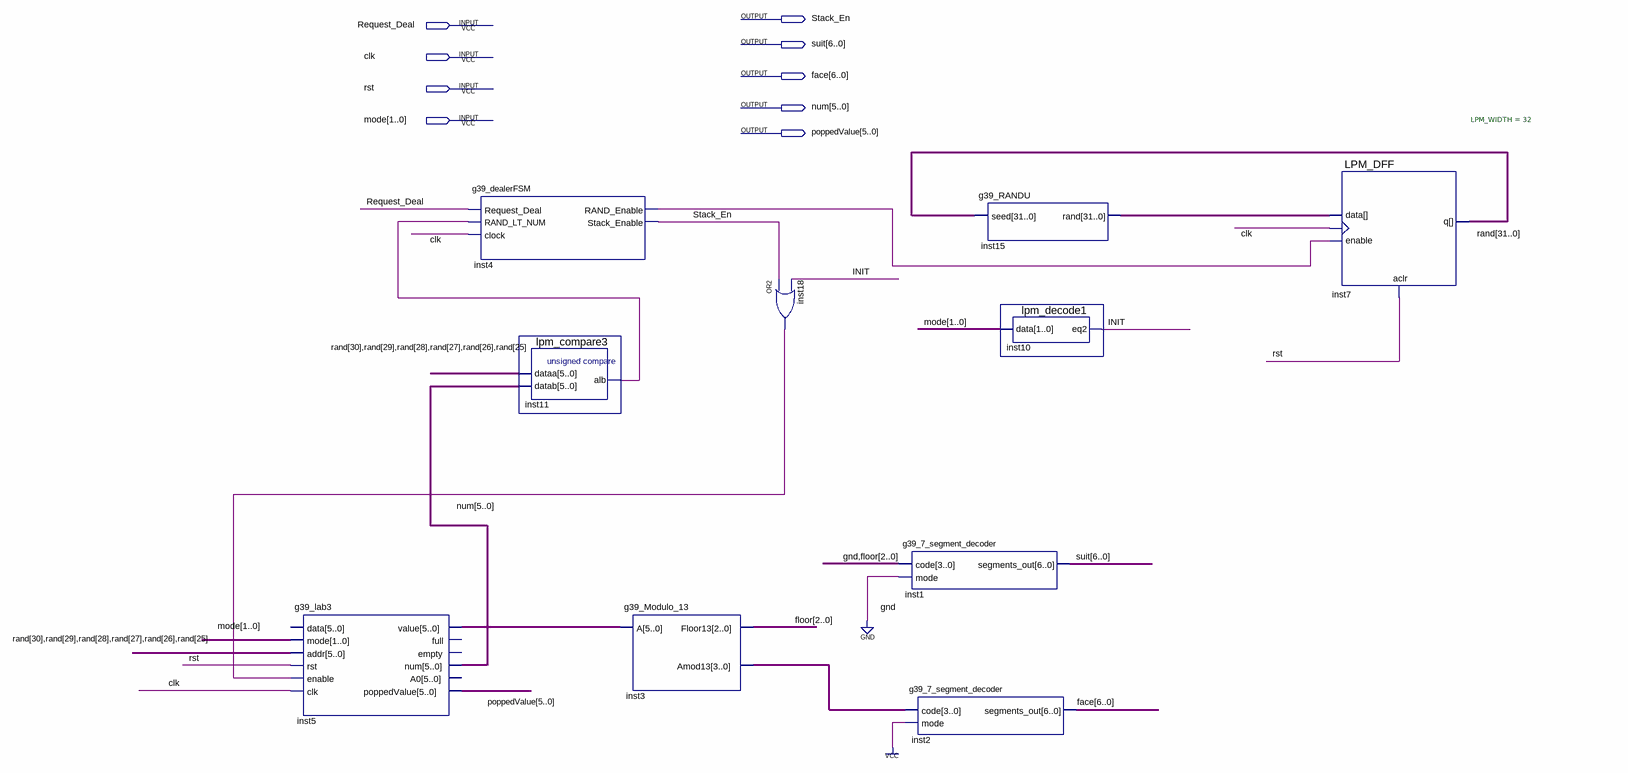
[diagram p0: schematic sheet]
// Quartus schematic g39_dealerTestBed.bdf as structural Verilog: 10 symbols, 9 pins
module g39_dealerTestBed (
  input  Request_Deal,
  input  clk,
  input  rst,
  input  [1:0] mode,
  output Stack_En,
  output [6:0] suit,
  output [6:0] face,
  output [5:0] num,
  output [5:0] poppedValue
);

  wire INIT, inst4_rand_enable, inst11_alb, inst18_out;
  wire [2:0] floor;
  wire [3:0] inst3_amod13;
  wire [5:0] inst5_value;
  wire [31:0] inst15_rand, \rand ;

  g39_lab3 inst5 (
    .mode(mode), .addr(\rand [30:25]), .rst(rst), .enable(inst18_out), .clk(clk), .value(inst5_value),
    .num(num), .poppedValue(poppedValue));  // open: data, full, empty, A0
  g39_dealerFSM inst4 (
    .Request_Deal(Request_Deal), .RAND_LT_NUM(inst11_alb), .clock(clk), .RAND_Enable(inst4_rand_enable),
    .Stack_Enable(Stack_En));
  lpm_compare3 inst11 (.dataa(\rand [30:25]), .datab(num), .alb(inst11_alb));
  g39_Modulo_13 inst3 (.A(inst5_value), .Amod13(inst3_amod13), .Floor13(floor));
  or inst18 (inst18_out, Stack_En, INIT);
  g39_7_segment_decoder inst1 (.code({1'b0, floor}), .mode(1'b0), .segments_out(suit));
  g39_7_segment_decoder inst2 (.code(inst3_amod13), .mode(1'b1), .segments_out(face));
  g39_RANDU inst15 (.seed(\rand ), .\rand (inst15_rand));
  lpm_decode1 inst10 (.data(mode), .eq2(INIT));
  LPM_DFF #(.LPM_WIDTH(32)) inst7 (.aclr(rst), .clock(clk), .data(inst15_rand), .enable(inst4_rand_enable), .q(\rand ));
endmodule
